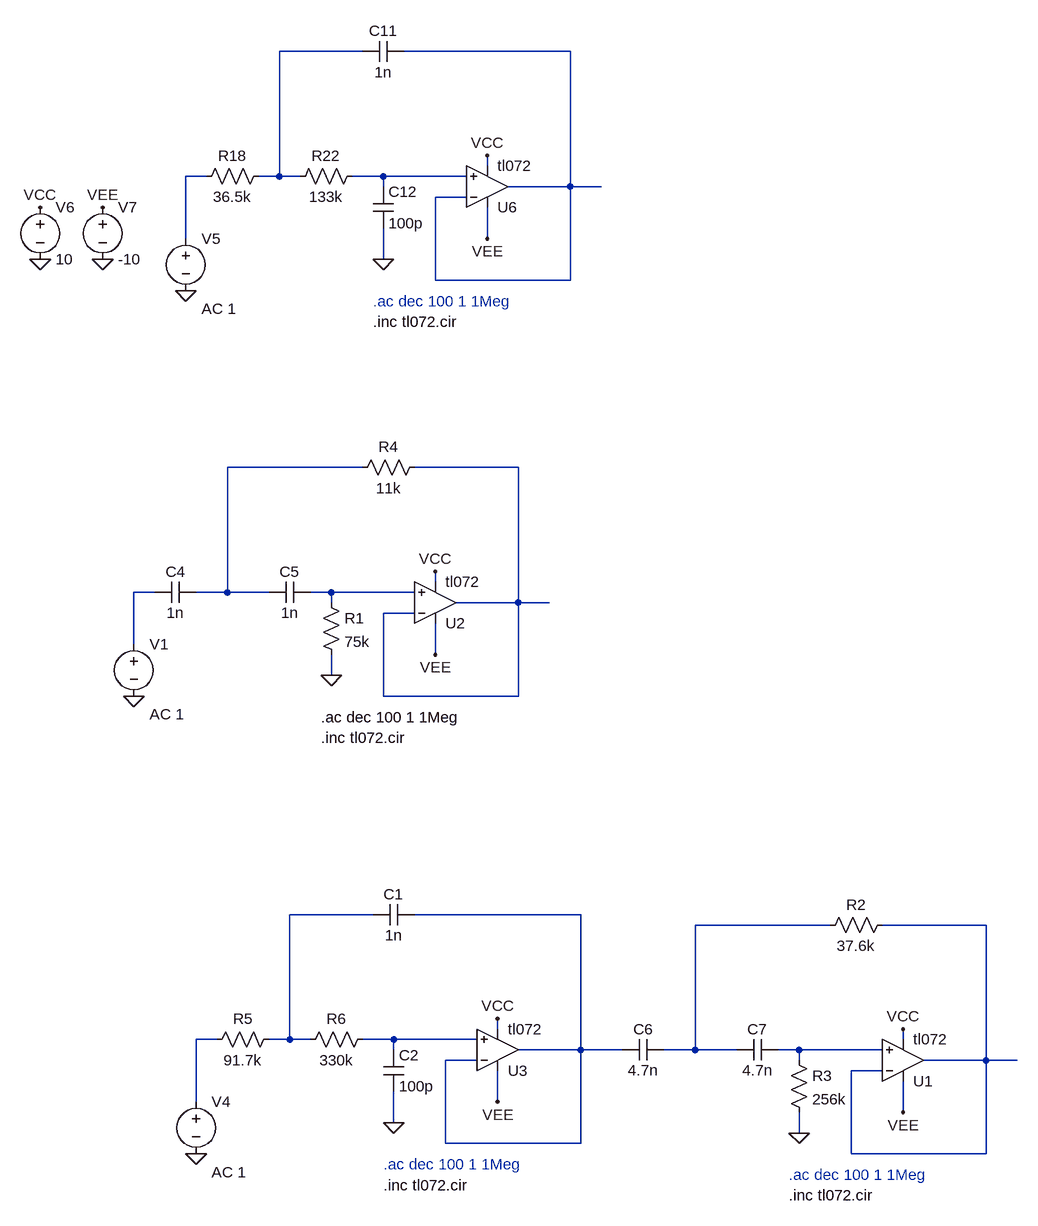
[diagram p0: schematic EQ.asc]
EQ.asc, the LTspice schematic file:
Version 4.1
SHEET 1 1268 1008
WIRE 80 -768 -48 -768
WIRE 400 -768 144 -768
WIRE 272 -592 272 -608
WIRE -160 -576 -192 -576
WIRE -48 -576 -48 -768
WIRE -48 -576 -80 -576
WIRE -16 -576 -48 -576
WIRE 112 -576 64 -576
WIRE 240 -576 112 -576
WIRE 112 -560 112 -576
WIRE 400 -560 400 -768
WIRE 400 -560 304 -560
WIRE 448 -560 400 -560
WIRE 240 -544 192 -544
WIRE -192 -480 -192 -576
WIRE 272 -480 272 -528
WIRE 112 -448 112 -496
WIRE 192 -416 192 -544
WIRE 400 -416 400 -560
WIRE 400 -416 192 -416
WIRE 80 -128 -128 -128
WIRE 320 -128 160 -128
WIRE 192 48 192 32
WIRE -240 64 -272 64
WIRE -128 64 -128 -128
WIRE -128 64 -176 64
WIRE -64 64 -128 64
WIRE 32 64 0 64
WIRE 160 64 32 64
WIRE 32 80 32 64
WIRE 320 80 320 -128
WIRE 320 80 224 80
WIRE 368 80 320 80
WIRE 160 96 112 96
WIRE -272 144 -272 64
WIRE 192 160 192 112
WIRE 32 192 32 160
WIRE 112 224 112 96
WIRE 320 224 320 80
WIRE 320 224 112 224
WIRE 96 560 -32 560
WIRE 416 560 160 560
WIRE 800 576 592 576
WIRE 1040 576 880 576
WIRE 288 736 288 720
WIRE -144 752 -176 752
WIRE -32 752 -32 560
WIRE -32 752 -64 752
WIRE 0 752 -32 752
WIRE 128 752 80 752
WIRE 256 752 128 752
WIRE 912 752 912 736
WIRE 128 768 128 752
WIRE 416 768 416 560
WIRE 416 768 320 768
WIRE 480 768 416 768
WIRE 592 768 592 576
WIRE 592 768 544 768
WIRE 656 768 592 768
WIRE 752 768 720 768
WIRE 880 768 752 768
WIRE 256 784 208 784
WIRE 752 784 752 768
WIRE 1040 784 1040 576
WIRE 1040 784 944 784
WIRE 1088 784 1040 784
WIRE 880 800 832 800
WIRE -176 848 -176 752
WIRE 288 848 288 800
WIRE 912 864 912 816
WIRE 128 880 128 832
WIRE 752 896 752 864
WIRE 208 912 208 784
WIRE 416 912 416 768
WIRE 416 912 208 912
WIRE 832 928 832 800
WIRE 1040 928 1040 784
WIRE 1040 928 832 928
FLAG 32 192 0
FLAG -272 224 0
FLAG 192 32 VCC
FLAG 192 160 VEE
FLAG 112 -448 0
FLAG -192 -400 0
FLAG -416 -448 0
FLAG -320 -448 0
FLAG -416 -528 VCC
FLAG -320 -528 VEE
FLAG 272 -608 VCC
FLAG 272 -480 VEE
FLAG 752 896 0
FLAG 912 736 VCC
FLAG 912 864 VEE
FLAG 128 880 0
FLAG -176 928 0
FLAG 288 720 VCC
FLAG 288 848 VEE
SYMBOL voltage -272 128 R0
WINDOW 123 24 124 Left 2
WINDOW 39 0 0 Left 0
SYMATTR Value2 AC 1
SYMATTR InstName V1
SYMATTR Value ""
SYMBOL OpAmps\\opamp2 192 144 M180
SYMATTR InstName U2
SYMATTR Value tl072
SYMBOL res 176 -144 R90
WINDOW 0 0 56 VBottom 2
WINDOW 3 32 56 VTop 2
SYMATTR InstName R4
SYMATTR Value 11k
SYMBOL cap -176 48 R90
WINDOW 0 0 32 VBottom 2
WINDOW 3 32 32 VTop 2
SYMATTR InstName C4
SYMATTR Value 1n
SYMBOL cap 0 48 R90
WINDOW 0 0 32 VBottom 2
WINDOW 3 32 32 VTop 2
SYMATTR InstName C5
SYMATTR Value 1n
SYMBOL res 16 64 R0
SYMATTR InstName R1
SYMATTR Value 75k
SYMBOL voltage -192 -496 R0
WINDOW 123 24 124 Left 2
WINDOW 39 0 0 Left 0
SYMATTR Value2 AC 1
SYMATTR InstName V5
SYMATTR Value ""
SYMBOL voltage -416 -544 R0
WINDOW 123 0 0 Left 0
WINDOW 39 0 0 Left 0
SYMATTR InstName V6
SYMATTR Value 10
SYMBOL voltage -320 -544 R0
WINDOW 123 0 0 Left 0
WINDOW 39 0 0 Left 0
SYMATTR InstName V7
SYMATTR Value -10
SYMBOL OpAmps\\opamp2 272 -496 M180
SYMATTR InstName U6
SYMATTR Value tl072
SYMBOL res -64 -592 R90
WINDOW 0 0 56 VBottom 2
WINDOW 3 32 56 VTop 2
SYMATTR InstName R18
SYMATTR Value 36.5k
SYMBOL res 80 -592 R90
WINDOW 0 0 56 VBottom 2
WINDOW 3 32 56 VTop 2
SYMATTR InstName R22
SYMATTR Value 133k
SYMBOL cap 144 -784 R90
WINDOW 0 0 32 VBottom 2
WINDOW 3 32 32 VTop 2
SYMATTR InstName C11
SYMATTR Value 1n
SYMBOL cap 96 -560 R0
SYMATTR InstName C12
SYMATTR Value 100p
SYMBOL OpAmps\\opamp2 912 848 M180
SYMATTR InstName U1
SYMATTR Value tl072
SYMBOL res 896 560 R90
WINDOW 0 0 56 VBottom 2
WINDOW 3 32 56 VTop 2
SYMATTR InstName R2
SYMATTR Value 37.6k
SYMBOL cap 544 752 R90
WINDOW 0 0 32 VBottom 2
WINDOW 3 32 32 VTop 2
SYMATTR InstName C6
SYMATTR Value 4.7n
SYMBOL cap 720 752 R90
WINDOW 0 0 32 VBottom 2
WINDOW 3 32 32 VTop 2
SYMATTR InstName C7
SYMATTR Value 4.7n
SYMBOL res 736 768 R0
SYMATTR InstName R3
SYMATTR Value 256k
SYMBOL voltage -176 832 R0
WINDOW 123 24 124 Left 2
WINDOW 39 0 0 Left 0
SYMATTR Value2 AC 1
SYMATTR InstName V4
SYMATTR Value ""
SYMBOL OpAmps\\opamp2 288 832 M180
SYMATTR InstName U3
SYMATTR Value tl072
SYMBOL res -48 736 R90
WINDOW 0 0 56 VBottom 2
WINDOW 3 32 56 VTop 2
SYMATTR InstName R5
SYMATTR Value 91.7k
SYMBOL res 96 736 R90
WINDOW 0 0 56 VBottom 2
WINDOW 3 32 56 VTop 2
SYMATTR InstName R6
SYMATTR Value 330k
SYMBOL cap 160 544 R90
WINDOW 0 0 32 VBottom 2
WINDOW 3 32 32 VTop 2
SYMATTR InstName C1
SYMATTR Value 1n
SYMBOL cap 112 768 R0
SYMATTR InstName C2
SYMATTR Value 100p
TEXT 16 288 Left 2 !.inc tl072.cir
TEXT 16 256 Left 2 !.ac dec 100 1 1Meg
TEXT 96 -352 Left 2 !.inc tl072.cir
TEXT 96 -384 Left 2 ;.ac dec 100 1 1Meg
TEXT 736 992 Left 2 !.inc tl072.cir
TEXT 736 960 Left 2 ;.ac dec 100 1 1Meg
TEXT 112 976 Left 2 !.inc tl072.cir
TEXT 112 944 Left 2 ;.ac dec 100 1 1Meg

The netlist it stands for:
* EQ.asc
V1 N007 0 AC 1
X§U2 N008 N006 VEE VCC N006 tl072  ; pins In+ In- V+ V- OUT
R4 N006 N005 11k
C4 N005 N007 1n
C5 N008 N005 1n
R1 N008 0 75k
V5 N003 0 AC 1
V6 VCC 0 10
V7 VEE 0 -10
X§U6 N004 N002 VEE VCC N002 tl072  ; pins In+ In- V+ V- OUT
R18 N001 N003 36.5k
R22 N004 N001 133k
C11 N002 N001 1n
C12 N004 0 100p
X§U1 N015 N012 VEE VCC N012 tl072  ; pins In+ In- V+ V- OUT
R2 N012 N011 37.6k
C6 N011 N010 4.7n
C7 N015 N011 4.7n
R3 N015 0 256k
V4 N013 0 AC 1
X§U3 N014 N010 VEE VCC N010 tl072  ; pins In+ In- V+ V- OUT
R5 N009 N013 91.7k
R6 N014 N009 330k
C1 N010 N009 1n
C2 N014 0 100p
.inc tl072.cir
.ac dec 100 1 1Meg
.inc tl072.cir
* .ac dec 100 1 1Meg
.inc tl072.cir
* .ac dec 100 1 1Meg
.inc tl072.cir
* .ac dec 100 1 1Meg
.backanno
.end